# Altium schematic sheet Overview.SchDoc
size A; SheetNumber: 1; SheetTotal: 3
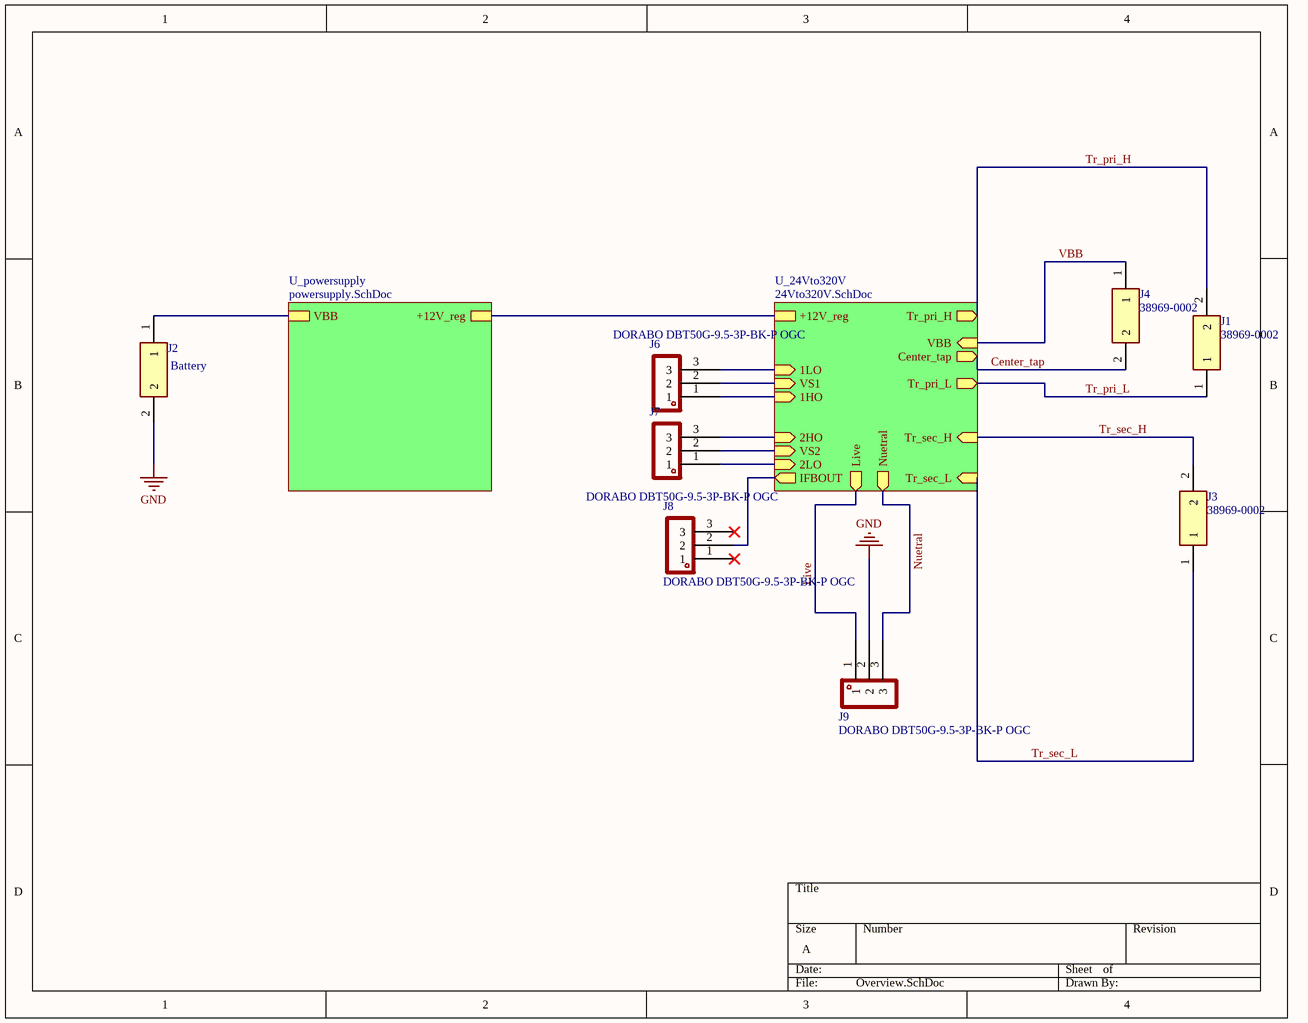
[diagram p0: Overview.SchDoc]

## Parts
J1  38969-0002  [389690002]
J2  Battery  [389690002]
J3  38969-0002  [389690002]
J4  38969-0002  [389690002]
J6  DORABO DBT50G-9.5-3P-BK-P OGC  [DORABO DBT50G-9.5-3P-BK-P OGC]
J7  DORABO DBT50G-9.5-3P-BK-P OGC  [DORABO DBT50G-9.5-3P-BK-P OGC]
J8  DORABO DBT50G-9.5-3P-BK-P OGC  [DORABO DBT50G-9.5-3P-BK-P OGC]
J9  DORABO DBT50G-9.5-3P-BK-P OGC  [DORABO DBT50G-9.5-3P-BK-P OGC]

## Sub-sheets
U_24Vto320V = 24Vto320V.SchDoc: +12V_reg, Tr_sec_H (in), Tr_pri_L (out), Tr_sec_L (in), Center_tap (out), 2LO (in), Nuetral (out), Live (out), 1LO (in), IFBOUT (out), 1HO (in), VS1 (in), 2HO (in), VS2 (in), Tr_pri_H (out), VBB (in)
U_powersupply = powersupply.SchDoc: VBB, +12V_reg

## Nets
GND: J2.2 J9.2
Center_tap: J4.2 ; sheet U_24Vto320V/Center_tap
Live: J9.1 ; sheet U_24Vto320V/Live
Nuetral: J9.3 ; sheet U_24Vto320V/Nuetral
Tr_pri_H: J1.2 ; sheet U_24Vto320V/Tr_pri_H
Tr_pri_L: J1.1 ; sheet U_24Vto320V/Tr_pri_L
Tr_sec_H: J3.2 ; sheet U_24Vto320V/Tr_sec_H
Tr_sec_L: J3.1 ; sheet U_24Vto320V/Tr_sec_L
VBB: J4.1 ; sheet U_24Vto320V/VBB
NetJ2_1: J2.1 ; sheet U_powersupply/VBB
NetJ6_1: J6.1 ; sheet U_24Vto320V/1HO
NetJ6_2: J6.2 ; sheet U_24Vto320V/VS1
NetJ6_3: J6.3 ; sheet U_24Vto320V/1LO
NetJ7_1: J7.1 ; sheet U_24Vto320V/2LO
NetJ7_2: J7.2 ; sheet U_24Vto320V/VS2
NetJ7_3: J7.3 ; sheet U_24Vto320V/2HO
NetJ8_2: J8.2 ; sheet U_24Vto320V/IFBOUT
(unnamed): sheet U_24Vto320V/+12V_reg, sheet U_powersupply/+12V_reg

Not connected (* = marked no-connect by the designer): J8 1* 3*

## Library data of the parts
J1 J3 J4 = 38969-0002: Connector; Manufacturer_Name: Molex; Datasheet Link: https://www.mouser.com/datasheet/2/276/0389690002_TERMINAL_BLOCKS-138581.pdf; Height: 21.9mm; Manufacturer_Part_Number: 38969-0002; Mouser Part Number: 538-38969-0002; Mouser Price/Stock: https://www.mouser.co.uk/ProductDetail/Molex/38969-0002?qs=%2Fs3Y63xoe9mbpbSgf7b48A%3D%3D
J2 = 38969-0002: Manufacturer_Name: Molex; Datasheet Link: https://www.mouser.com/datasheet/2/276/0389690002_TERMINAL_BLOCKS-138581.pdf; Height: 21.9mm; Manufacturer_Part_Number: 38969-0002; Mouser Part Number: 538-38969-0002; Mouser Price/Stock: https://www.mouser.co.uk/ProductDetail/Molex/38969-0002?qs=%2Fs3Y63xoe9mbpbSgf7b48A%3D%3D